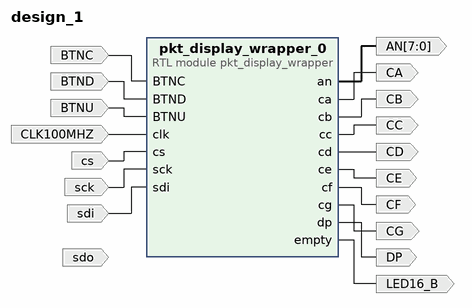
[diagram p0: block diagram of the top level]
# Vivado block design design_1, xc7a100tcsg324-1, Vivado 2023.2
create_bd_design design_1

create_bd_port -dir I -type clk CLK100MHZ
set_property -dict {CONFIG.FREQ_HZ 100000000} [get_bd_ports CLK100MHZ]
create_bd_port -dir I BTND
create_bd_port -dir I BTNU
create_bd_port -dir I sdo
create_bd_port -dir I sdi
create_bd_port -dir I cs
create_bd_port -dir I sck
create_bd_port -dir O CA
create_bd_port -dir O CB
create_bd_port -dir O CC
create_bd_port -dir O CD
create_bd_port -dir O CE
create_bd_port -dir O CF
create_bd_port -dir O CG
create_bd_port -dir O LED16_B
create_bd_port -dir O -from 7 -to 0 AN
create_bd_port -dir I BTNC
create_bd_port -dir O DP

create_bd_cell -type module -reference pkt_display_wrapper pkt_display_wrapper_0

# ---- connections ----

connect_bd_net [get_bd_ports BTNC] [get_bd_pins pkt_display_wrapper_0/BTNC]
connect_bd_net [get_bd_ports BTND] [get_bd_pins pkt_display_wrapper_0/BTND]
connect_bd_net [get_bd_ports BTNU] [get_bd_pins pkt_display_wrapper_0/BTNU]
connect_bd_net [get_bd_ports CLK100MHZ] [get_bd_pins pkt_display_wrapper_0/clk]
connect_bd_net [get_bd_ports cs] [get_bd_pins pkt_display_wrapper_0/cs]
connect_bd_net [get_bd_pins pkt_display_wrapper_0/an] [get_bd_ports AN]
connect_bd_net [get_bd_pins pkt_display_wrapper_0/ca] [get_bd_ports CA]
connect_bd_net [get_bd_pins pkt_display_wrapper_0/cb] [get_bd_ports CB]
connect_bd_net [get_bd_pins pkt_display_wrapper_0/cc] [get_bd_ports CC]
connect_bd_net [get_bd_pins pkt_display_wrapper_0/cd] [get_bd_ports CD]
connect_bd_net [get_bd_pins pkt_display_wrapper_0/ce] [get_bd_ports CE]
connect_bd_net [get_bd_pins pkt_display_wrapper_0/cf] [get_bd_ports CF]
connect_bd_net [get_bd_pins pkt_display_wrapper_0/cg] [get_bd_ports CG]
connect_bd_net [get_bd_pins pkt_display_wrapper_0/dp] [get_bd_ports DP]
connect_bd_net [get_bd_pins pkt_display_wrapper_0/empty] [get_bd_ports LED16_B]
connect_bd_net [get_bd_ports sck] [get_bd_pins pkt_display_wrapper_0/sck]
connect_bd_net [get_bd_ports sdi] [get_bd_pins pkt_display_wrapper_0/sdi]
# net sdo_1 has one end: sdo

validate_bd_design
save_bd_design
